# EAGLE design xmega-128a4u-switch (EAGLE 8.3.2)
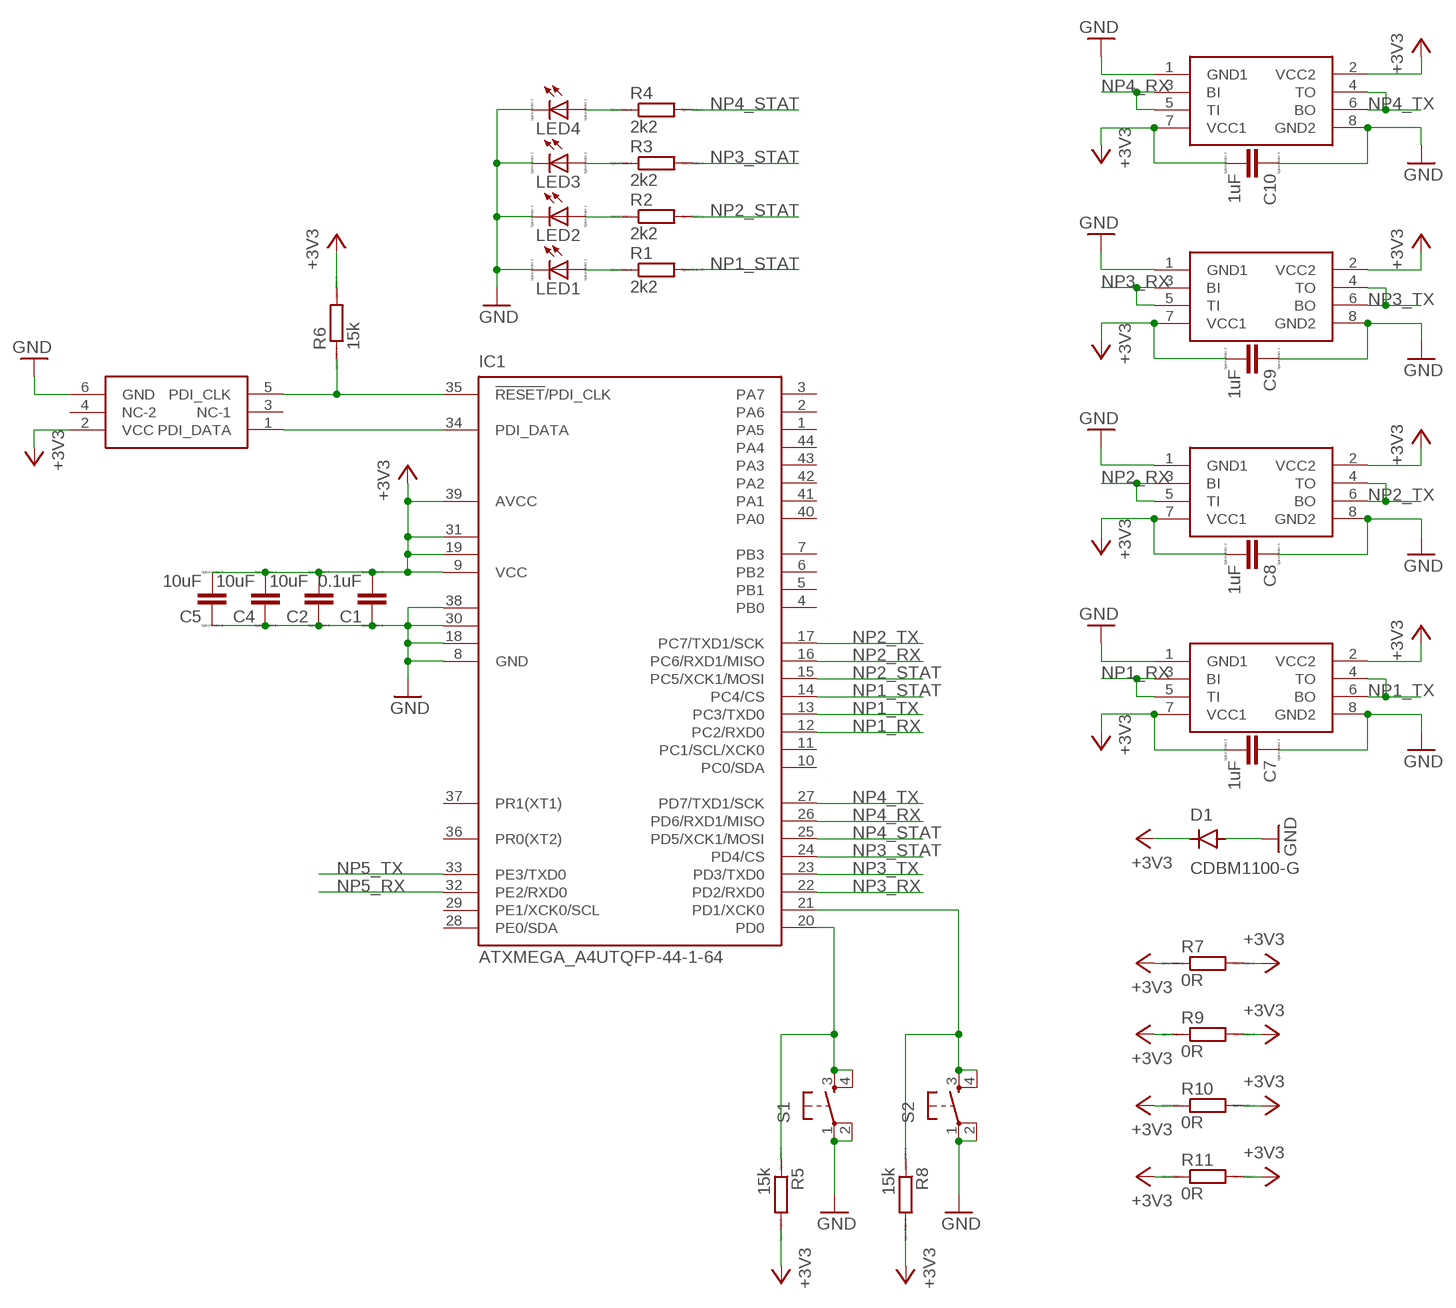
[diagram p0: schematic, sheet 1]

## Parts
C1  0.1uF  C  [C0805]
C2  10uF  CC1206  [C1206]
C4  10uF  CC1206  [C1206]
C5  10uF  CC1206  [C1206]
C7  1uF  C  [C0805]
C8  1uF  C  [C0805]
C9  1uF  C  [C0805]
C10  1uF  C  [C0805]
D1  CDBM1100-G  [MINI-SMA]
IC1  ATXMEGA_A4UTQFP-44-1-64  [TQFP44-13THIN]
LED1  LED_E  [LED_1206]
LED2  LED_E  [LED_1206]
LED3  LED_E  [LED_1206]
LED4  LED_E  [LED_1206]
R1  2k2  RR1206  [R1206]
R2  2k2  RR1206  [R1206]
R3  2k2  RR1206  [R1206]
R4  2k2  RR1206  [R1206]
R5  15k  R  [R0805]
R6  15k  R  [R0805]
R7  0R  RR1206  [R1206]
R8  15k  R  [R0805]
R9  0R  RR1206  [R1206]
R10  0R  RR1206  [R1206]
R11  0R  RR1206  [R1206]
S1  6MM_SWITCH6MM_SWITCH  [6MM_SWITCH]
S2  6MM_SWITCH6MM_SWITCH  [6MM_SWITCH]
U$3  NETPORT_IDC_FULLFLIP  [2X04SMD]
U$4  NETPORT_IDC_FULLFLIP  [2X04SMD]
U$5  NETPORT_IDC_FULLFLIP  [2X04SMD]
U$6  NETPORT_IDC_FULLFLIP  [2X04SMD]
U$7  PDI  [2X03SMD]

## Nets
+3V3: C1.2 C2.2 C4.2 C5.2 C7.2 C8.2 C9.2 C10.2 D1.KATHODE IC1.9(VCC) IC1.19(VCC1) IC1.31(VCC2) IC1.39(AVCC) R5.2 R6.2 R7.1 R7.2 R8.2 R9.1 R9.2 R10.1 R10.2 R11.1 R11.2 U$3.2(VCC2) U$3.7(VCC1) U$4.2(VCC2) U$4.7(VCC1) U$5.2(VCC2) U$5.7(VCC1) U$6.2(VCC2) U$6.7(VCC1) U$7.2(VCC)
GND: C1.1 C2.1 C4.1 C5.1 C7.1 C8.1 C9.1 C10.1 D1.ANODE IC1.8(GND) IC1.18(GND1) IC1.30(GND2) IC1.38(GND3) LED1.C LED2.C LED3.C LED4.C S1.1(P) S1.2(P1) S2.1(P) S2.2(P1) U$3.1(GND1) U$3.8(GND2) U$4.1(GND1) U$4.8(GND2) U$5.1(GND1) U$5.8(GND2) U$6.1(GND1) U$6.8(GND2) U$7.6(GND)
N$1: LED4.A R4.1
N$2: LED3.A R3.1
N$3: LED2.A R2.1
N$4: LED1.A R1.1
N$5: IC1.35(!RESET!/PDI_CLK) R6.1 U$7.5(PDI_CLK)
N$6: IC1.34(PDI_DATA) U$7.1(PDI_DATA)
N$7: IC1.20(PD0) R5.1 S1.3(S) S1.4(S1)
N$9: IC1.21(PD1/XCK0) R8.1 S2.3(S) S2.4(S1)
NP1_RX: IC1.12(PC2/RXD0) U$3.3(BI) U$3.5(TI)
NP1_STAT: IC1.14(PC4/CS) R1.2
NP1_TX: IC1.13(PC3/TXD0) U$3.4(TO) U$3.6(BO)
NP2_RX: IC1.16(PC6/RXD1/MISO) U$4.3(BI) U$4.5(TI)
NP2_STAT: IC1.15(PC5/XCK1/MOSI) R2.2
NP2_TX: IC1.17(PC7/TXD1/SCK) U$4.4(TO) U$4.6(BO)
NP3_RX: IC1.22(PD2/RXD0) U$5.3(BI) U$5.5(TI)
NP3_STAT: IC1.24(PD4/CS) R3.2
NP3_TX: IC1.23(PD3/TXD0) U$5.4(TO) U$5.6(BO)
NP4_RX: IC1.26(PD6/RXD1/MISO) U$6.3(BI) U$6.5(TI)
NP4_STAT: IC1.25(PD5/XCK1/MOSI) R4.2
NP4_TX: IC1.27(PD7/TXD1/SCK) U$6.4(TO) U$6.6(BO)
NP5_RX: IC1.32(PE2/RXD0)
NP5_TX: IC1.33(PE3/TXD0)
Unconnected: IC1.1(PA5) IC1.2(PA6) IC1.3(PA7) IC1.4(PB0) IC1.5(PB1) IC1.6(PB2) IC1.7(PB3) IC1.10(PC0/SDA) IC1.11(PC1/SCL/XCK0) IC1.28(PE0/SDA) IC1.29(PE1/XCK0/SCL) IC1.36(PR0(XT2)) IC1.37(PR1(XT1)) IC1.40(PA0) IC1.41(PA1) IC1.42(PA2) IC1.43(PA3) IC1.44(PA4) U$7.3(NC-1) U$7.4(NC-2)

## Library data of the parts
C1 C2 C4 C5 C7-C10 = eagle-ltspice:C: CAPACITOR, European symbol; SPICEMODEL: NONE; SPICEPREFIX: C
D1 = fab:CDBM1100-G: Diode schottky 100V 1A mini-SMA as found in the fablab inventory Reverse Voltage: 100 Volts Forward Current: 1.0 Amp Maximum forward voltage: 0.85 Volts Made by Zaerc.
IC1 = fab:ATXMEGA_A4U
LED1-LED4 = eagle-ltspice:LED_E: LED Source: http://www.osram.convergy.de Source: www.luxeon.com Source: www.kingbright.com; SPICEMODEL: NONE; SPICEPREFIX: D; SPICETYPE: diode
R1-R11 = eagle-ltspice:R: RESISTOR, European symbol; SPICEMODEL: NONE; SPICEPREFIX: R
S1 S2 = fab:6MM_SWITCH: OMRON SWITCH
U$3-U$6 = fab:NETPORT_IDC_FULLFLIP
U$7 = fab:PDI

## Board
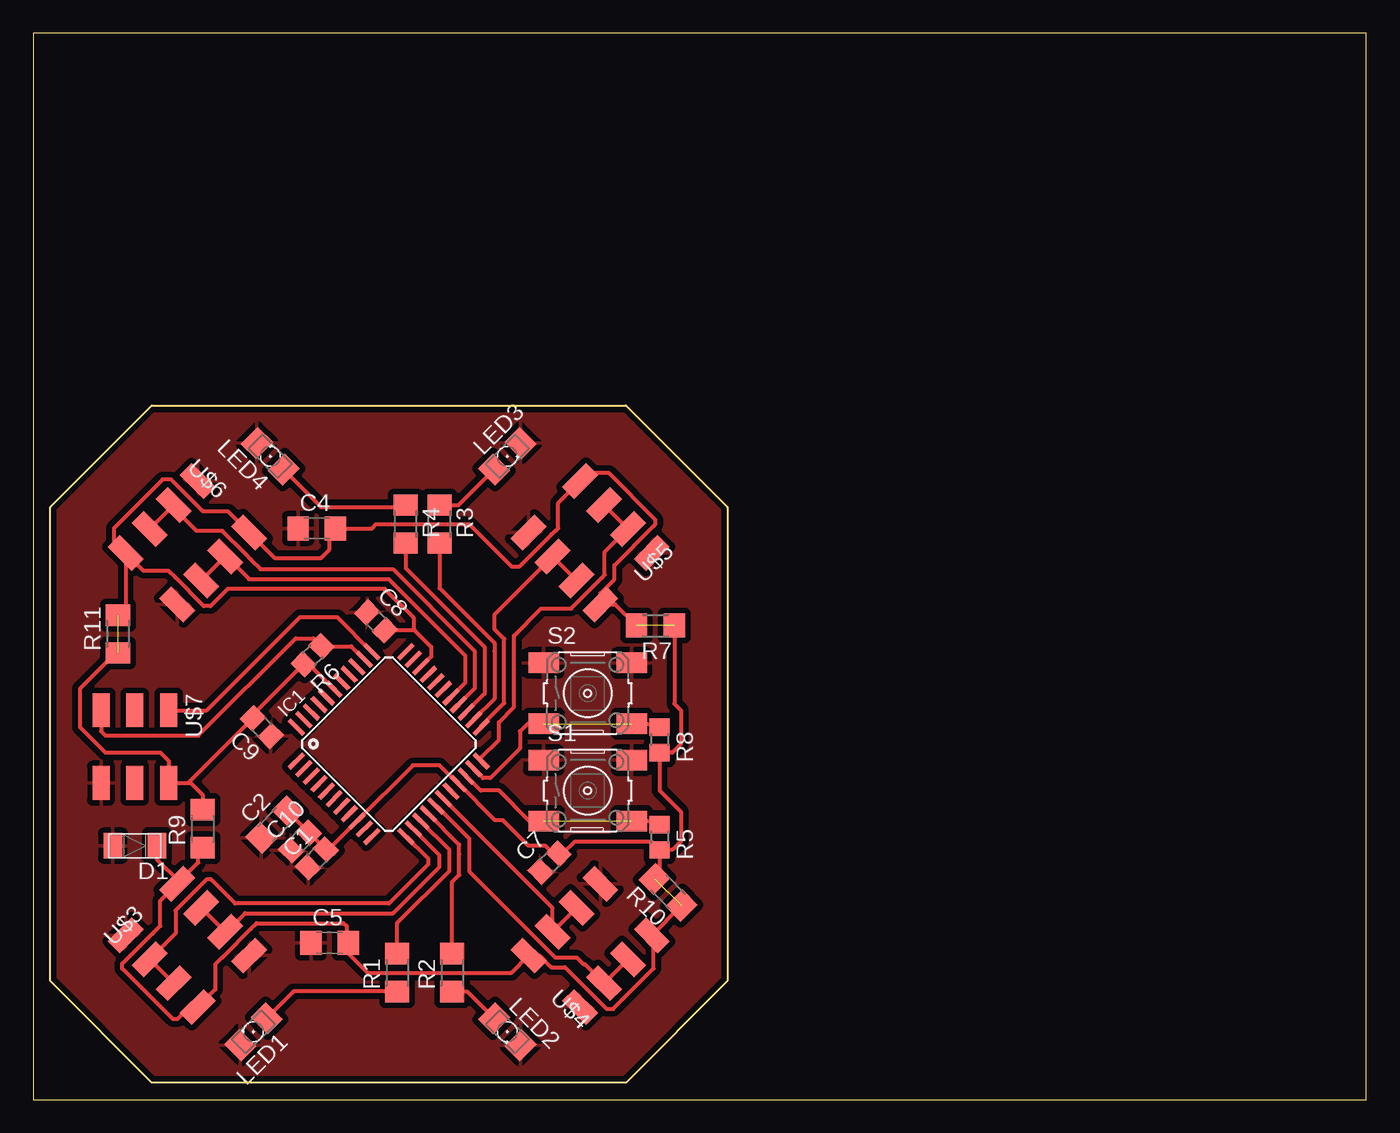
[diagram p1: board, top side]
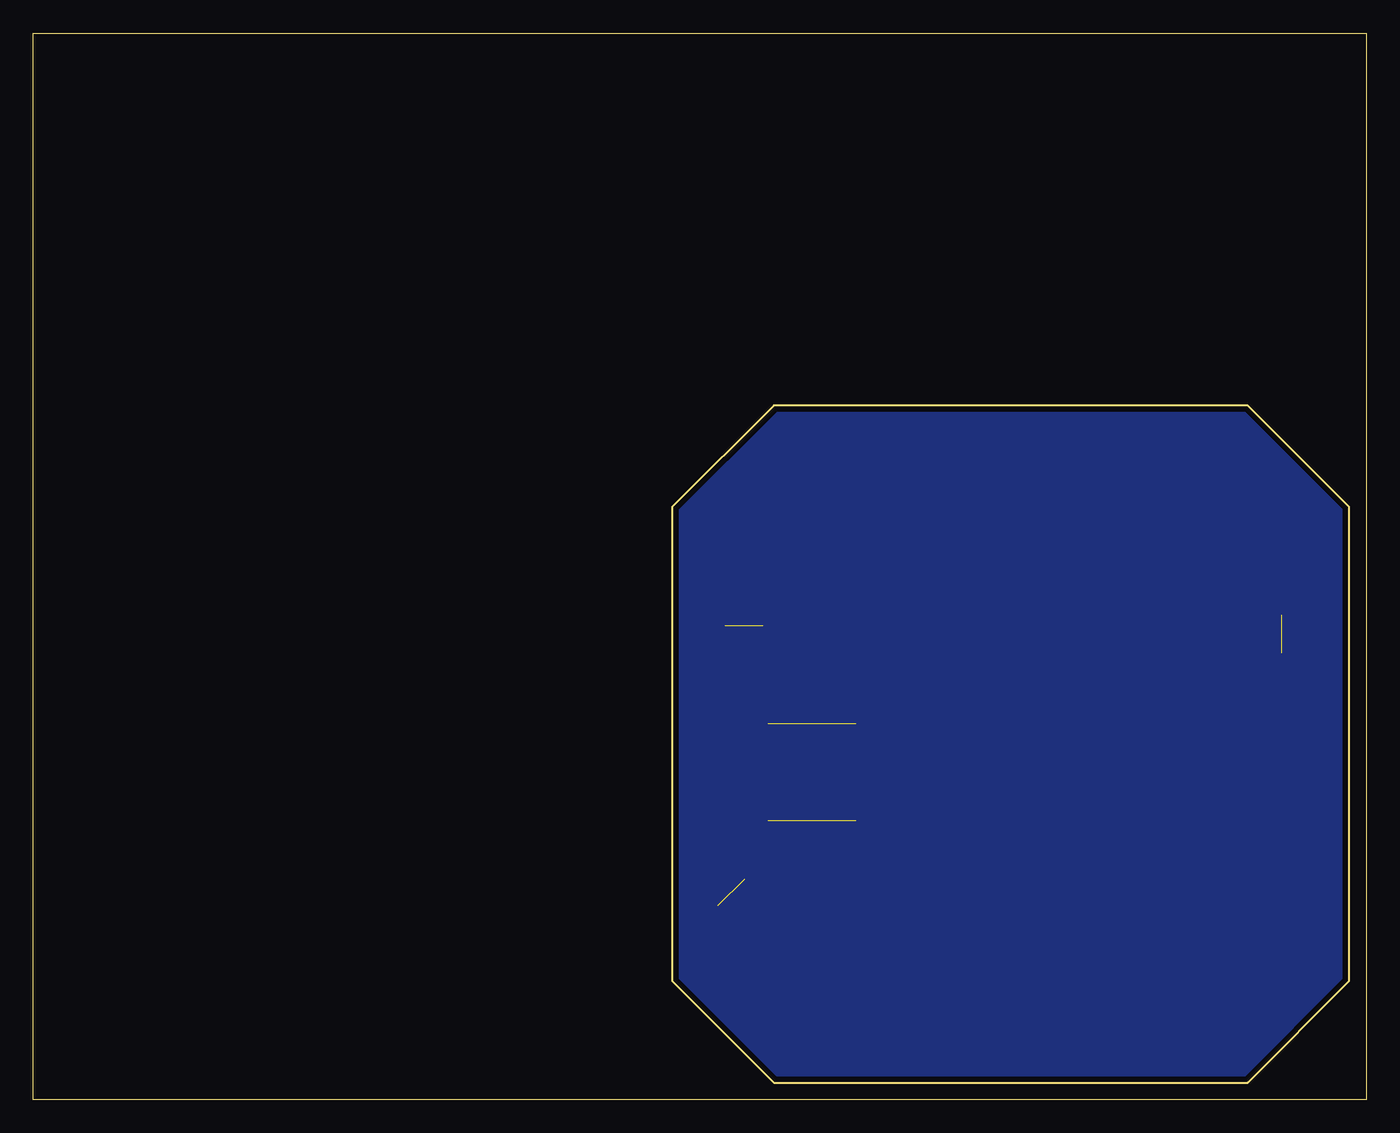
[diagram p2: board, bottom side, seen from below]

Size 100 x 80 mm. Coordinates in mm from the lower left corner, seen from the top.
Outline: 0,0 100,0 100,80 0,80 0,0
Outline: 1.27,44.45 8.89,52.07 44.45,52.07 52.07,44.45 52.07,8.89 44.45,1.27 8.89,1.27 1.27,8.89 1.27,44.45
Copper layers (1*16): Top 0.035mm / dielectric 1.5mm / Bottom 0.035mm
Design rules "default *": minimum track width 10mil, minimum drill 32mil, track to track 17mil, track to pad 17mil, pad to pad 17mil, via to via 17mil, smd to smd 17mil, copper to edge 16mil, drill to drill 16mil, minimum pad ring 10mil, minimum via ring 8mil, stop-mask expansion 4mil, vias tented up to drill 0mil, thermal gap 16mil

### Footprints (pad centres in the part's own frame; a part is rotated, then mirrored left to right if it is on the bottom)
C0805 = smd 1.3 x 1.5: 1 -0.95,0; 2 0.95,0
C1206 = smd 1.6 x 1.8: 1 -1.4,0; 2 1.4,0
MINI-SMA = smd 1.4 x 1.9: ANODE 1.65,0; KATHODE -1.65,0
TQFP44-13THIN = smd 1.524 x 0.33: 1 -5.8,4; 2 -5.8,3.2; 3 -5.8,2.4; 4 -5.8,1.6; 5 -5.8,0.8; 6 -5.8,0; 7 -5.8,-0.8; 8 -5.8,-1.6; 9 -5.8,-2.4; 10 -5.8,-3.2; 11 -5.8,-4; 23 5.8,-4; 24 5.8,-3.2; 25 5.8,-2.4; 26 5.8,-1.6; 27 5.8,-0.8; 28 5.8,0; 29 5.8,0.8; 30 5.8,1.6; 31 5.8,2.4; 32 5.8,3.2; 33 5.8,4 | smd 0.33 x 1.524: 12 -4,-5.8; 13 -3.2,-5.8; 14 -2.4,-5.8; 15 -1.6,-5.8; 16 -0.8,-5.8; 17 0,-5.8; 18 0.8,-5.8; 19 1.6,-5.8; 20 2.4,-5.8; 21 3.2,-5.8; 22 4,-5.8; 34 4,5.8; 35 3.2,5.8; 36 2.4,5.8; 37 1.6,5.8; 38 0.8,5.8; 39 0,5.8; 40 -0.8,5.8; 41 -1.6,5.8; 42 -2.4,5.8; 43 -3.2,5.8; 44 -4,5.8
LED_1206 = smd 1.6 x 1.803: A -1.422,0; C 1.422,0
R1206 = smd 1.6 x 1.803: 1 -1.422,0; 2 1.422,0
R0805 = smd 1.3 x 1.5: 1 -0.95,0; 2 0.95,0
6MM_SWITCH = smd 2.286 x 1.524: 1 -3.302,2.286; 2 3.302,2.286; 3 -3.302,-2.286; 4 3.302,-2.286
2X04SMD = smd 2.54 x 1.27: 1 -2.54,3.81; 2 2.92,3.81; 3 -2.54,1.27; 4 2.92,1.27; 5 -2.54,-1.27; 6 2.92,-1.27; 7 -2.54,-3.81; 8 2.92,-3.81
2X03SMD = smd 2.54 x 1.27: 1 -2.54,2.54; 2 2.92,2.54; 3 -2.54,0; 4 2.92,0; 5 -2.54,-2.54; 6 2.92,-2.54

### Placement (x,y rotation side)
C1  21.27,18.1 45 top
C2  18.1,20.64 45 top
C4  21.27,42.86 0 top
C5  22.23,11.75 0 top
C7  38.73,17.78 45 top
C8  25.72,35.88 315 top
C9  17.14,27.94 135 top
C10  20,19.37 45 top
D1  7.62,19.05 180 top
IC1  26.67,26.67 45 top
LED1  16.51,5.08 225 top
LED2  35.56,5.08 315 top
LED3  35.56,48.26 45 top
LED4  17.78,48.26 135 top
R1  27.3,9.53 90 top
R2  31.43,9.53 90 top
R3  30.48,43.18 270 top
R4  27.94,43.18 270 top
R5  46.99,19.68 270 top
R6  20.95,33.34 225 top
R7  46.67,35.56 180 top
R8  46.99,26.99 270 top
R9  12.7,20.32 90 top
R10  47.62,15.56 135 top
R11  6.35,34.92 90 top
S1  41.59,23.18 0 top
S2  41.59,30.48 0 top
U$3  11.43,11.43 45 top
U$4  41.91,11.43 135 top
U$5  41.91,41.91 225 top
U$6  11.43,41.91 315 top
U$7  7.62,26.67 270 top

### Tracks (layer width: path | path; a pad name or v marks a point on that pad's centre or on a via)
+3V3  (3 unrouted)
  Top 0.305: 11.61,23.75 U$7.2 10.16,25.4 9.53,26.04 5.4,26.04 3.49,27.94 3.49,30.8 6.2,33.5 R11.1 | 11.61,23.75 C9.2 16.47,28.86 R6.2 20.67,32.67 IC1.39 22.64,30.77 | 28.61,35.21 C8.2 | 28.61,35.21 29.84,33.97 29.84,33.24 IC1.31 | R5.2 46.36,19.37 40.64,19.37 39.72,18.45 C7.2 39.02,18.45 38.42,19.05 37.15,19.05 35.24,20.95 34.65,20.95 IC1.19 31.86,23.7 30.48,25.08 28.48,25.08 IC1.9 22.16,18.77 C1.2 C10.2 C2.2 | 14.3,10.78 16.32,12.8 16.75,13.23 23.28,13.23 23.5,13.02 23.5,11.88 C5.2 23.62,10.98 25.08,9.53 35.88,9.53 U$4.2 37.98,10.8 38.85,9.93 39.89,9.93 40.94,8.88 | 14.3,10.78 | 14.3,10.78 14.19,10.66 14.16,10.66 13.65,10.16 13.65,8.26 12.7,7.3 12.69,7.3 U$3.7 11.7,6.94 10.79,6.03 10.48,6.03 6.67,9.84 6.67,10.19 8.94,12.46 8.97,12.46 9.53,13.02 9.53,14.91 U$3.2 10.95,16.35 | R8.2 | R8.2 46.99,23.18 48.58,21.59 48.58,19.37 47.94,18.73 R5.2 | 10.49,46.37 12.46,44.4 12.73,44.13 14.61,44.13 U$6.2 18.1,40.64 21.59,40.64 22.23,41.27 22.23,42.41 C4.2 25.4,42.86 25.72,43.18 32.7,43.18 35.88,40.01 36.48,40.01 37.02,40.54 38.88,42.4 | 10.49,46.37 | 10.49,46.37 10.32,46.53 9.71,46.53 6.03,42.86 6.03,41.92 U$6.7 | 11.61,23.75 11.81,23.75 12.7,22.86 R9.2 | 10.95,16.35 12.38,17.78 12.38,18.58 R9.1 | R7.2 43.66,37.15 U$5.2 42.54,37.98 43.6,39.04 43.6,40.08 46.53,43.02 46.53,43.04 46.67,43.18 46.67,43.5 43.18,46.99 41.6,46.99 U$5.7 39.37,44.76 39.37,42.86 39.18,42.67 39.15,42.67 39.04,42.56 | R7.1 48.09,29.69 48.58,29.21 48.58,26.67 47.94,26.04 R8.2 | 40.94,8.88 | 40.94,8.88 43.02,6.8 43.5,6.8 46.53,9.84 46.53,12.19 U$4.7 R10.1 | R5.2 46.99,16.93 R10.2 | U$6.7 6.94,36.94 R11.2
  Top 0.305: D1.KATHODE 9.27,18.04 10.95,16.35 | U$6.7 8.26,39.69 10.13,39.69 10.66,39.15 12.69,37.13 | 12.69,37.13 | 12.69,37.13 12.8,37.02 13.29,37.02 14.59,38.32 26.25,38.32 | 26.25,38.32 | 26.25,38.32 26.36,38.32 28.53,36.15 28.53,35.29 28.61,35.21 | 38.88,42.4 | 38.88,42.4 39.04,42.56 | 39.04,42.56
GND
  pour Top (isolate 0.406): 1.27,44.45 8.89,52.07 44.45,52.07 52.07,44.45 52.07,8.89 44.45,1.27 8.89,1.27 1.27,8.89
N$1
  Top 0.305: LED4.A | R4.1 27.79,44.45 21.59,44.45 LED4.A
N$2
  Top 0.305: R3.1 31.9,44.6 LED3.A
N$3
  Top 0.305: R2.1 32.54,8.1 LED2.A
N$4
  Top 0.305: R1.1 19.53,8.1 LED1.A
N$5
  Top 0.305: IC1.35 23.86,34.01 R6.1 21.03,34.61 19.68,34.61 12.38,27.3 5.4,27.3 5.08,27.62 U$7.5
N$6
  Top 0.305: U$7.1 13.02,29.21 20,36.2 22.8,36.2 IC1.34
N$7  (1 unrouted)
  Top 0.305: S1.3 37.21,20.89 34.92,23.18 33.56,23.18 IC1.20 | S1.4 46.73,20.89 R5.1
N$8
  pour Bottom: 1.27,44.45 8.89,52.07 44.45,52.07 52.07,44.45 52.07,8.89 44.45,1.27 8.89,1.27 1.27,8.89
N$9  (1 unrouted)
  Top 0.305: S2.3 37.08,28.19 36.51,27.62 36.51,26.35 34.29,24.13 33.73,24.13 IC1.21 | S2.4 46.73,28.19 R8.1
NP1_RX
  Top 0.305: IC1.12 29.64,18.04 29.64,17.67 26.68,14.71 15.14,14.71 13.34,16.51 12.99,16.51 12.8,16.32 12.05,15.57 | 12.05,15.57 | 12.05,15.57 10.66,14.19 10.66,12.46 U$3.3 U$3.5
NP1_STAT
  Top 0.305: R1.2 27.3,13.25 31.22,17.16 31.22,18.73 IC1.14
NP1_TX
  Top 0.305: IC1.13 30.48,18.34 30.48,17.46 26.99,13.97 15.88,13.97 14.5,12.6 U$3.6 U$3.4
NP2_RX
  Top 0.305: IC1.16 30.28,22 32.7,19.58 32.7,17.12 39.15,10.66 40.77,10.66 41.27,10.16 41.38,10.16 U$4.3 U$4.5
NP2_STAT
  Top 0.305: R2.2 31.43,16.33 31.95,16.85 31.95,18.42 | 31.95,18.42 | 31.95,18.42 31.95,19.12 IC1.15
NP2_TX
  Top 0.305: U$4.6 U$4.4 38.95,14.39 IC1.17
NP3_RX
  Top 0.305: U$5.5 U$5.3 42.86,41.07 42.86,39.37 42.67,39.18 42.67,39.15 40.35,36.83 38.1,36.83 36.07,34.8 36.07,34.25 | IC1.22 33.6,25.66 34.92,26.99 34.92,28.3 36.07,29.44 36.07,34.25 | 36.07,34.25
NP3_STAT
  Top 0.305: R3.2 30.48,38.37 34.59,34.25 34.59,33.64 | 34.59,33.64 | IC1.24 34.59,30.07 34.59,33.64
NP3_TX
  Top 0.305: U$5.4 U$5.6 34.61,36.4 34.61,35.28 35.33,34.56 35.33,29.75 33.6,28.01 IC1.23
NP4_RX
  Top 0.305: 10.43,44.5 U$6.5 | 10.43,44.5 U$6.3 | 15.89,40.97 14.19,42.67 12.25,42.67 10.43,44.5 | 15.89,40.97 | 15.89,40.97 16.32,40.54 16.32,40.51 17.04,39.79 26.98,39.79 32.69,34.07 | 32.69,34.07 | 32.69,34.07 33.12,33.64 33.12,30.86 IC1.26
NP4_STAT
  Top 0.305: R4.2 27.94,39.87 33.86,33.95 33.86,30.46 IC1.25
NP4_TX
  Top 0.305: U$6.6 U$6.4 14.5,40.74 16.19,39.05 26.67,39.05 32.38,33.34 32.38,31.25 IC1.27